# EAGLE design cerebro5.1 (EAGLE 7.7.0)
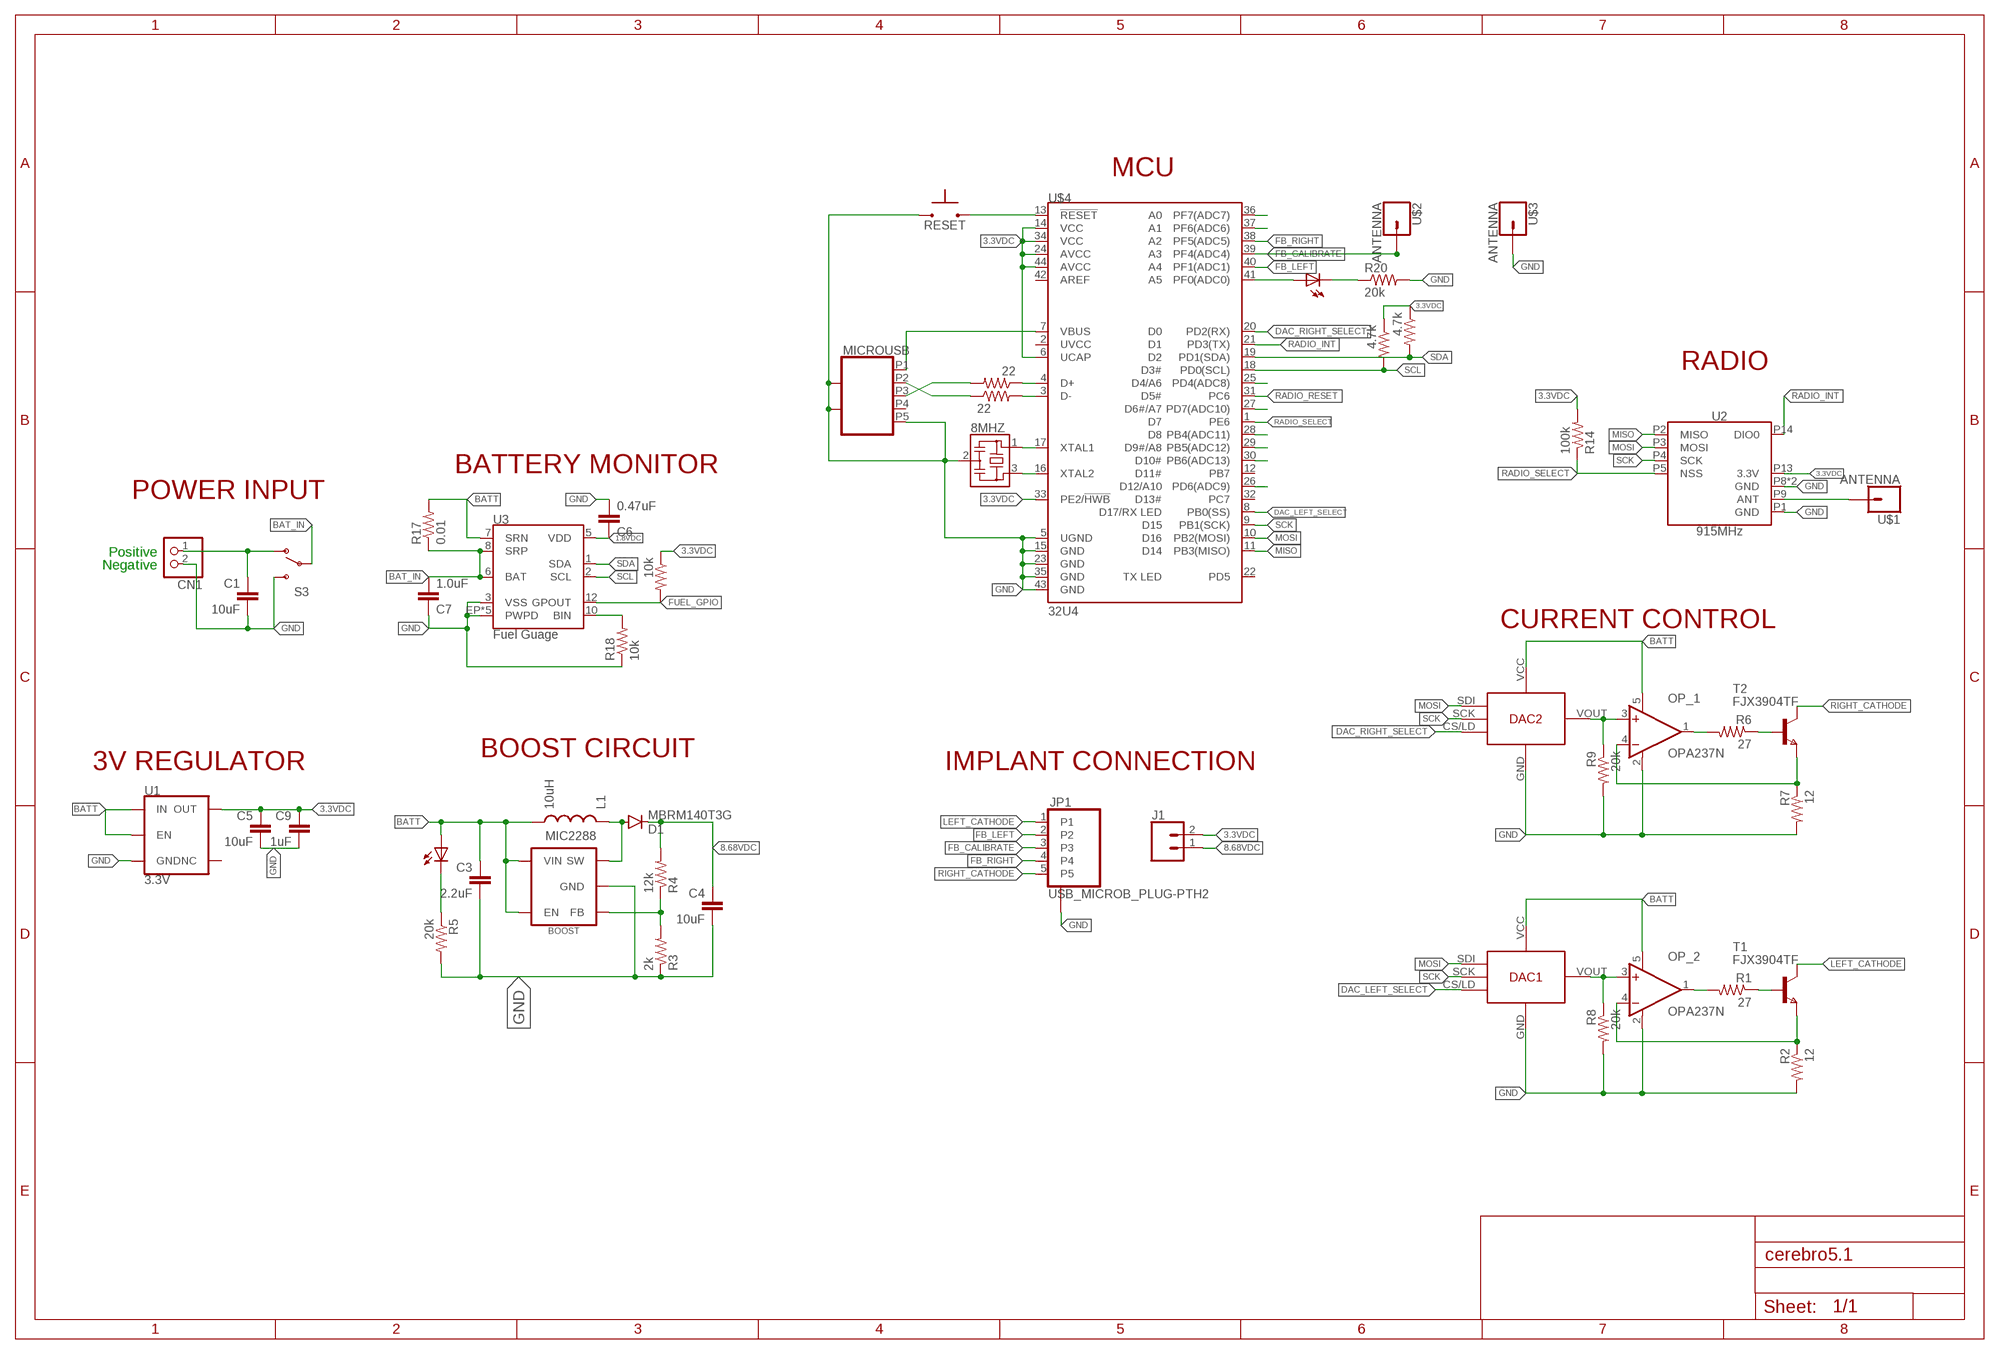
[diagram p0: schematic, sheet 1]

## Parts
8MHZ  RESONATOR_CSTCE_V  [CSTCE_V]
C1  10uF  10UF-0805-10V-10%  [0805]
C3  2.2uF  2.2UF-0805-25V-(+80/-20%)  [0805]
C4  10uF  10UF-0805-10V-10%  [0805]
C5  10uF  10UF-0805-10V-10%  [0805]
C6  0.47uF  10UF-0805-10V-10%  [0805]
C7  1.0uF  10UF-0805-10V-10%  [0805]
C9  1uF  10UF-0805-10V-10%  [0805]
CN1  JST_2PIN-SMT-RA  [JST-PH-2-SMT-RA]
D1  MBRM140T3G  DIODEPOWERMITE  [POWERMITE]
DAC1  DAC_LTC2630  [SC-70]
DAC2  DAC_LTC2630  [SC-70]
INDICATOR_LED  LED  LEDCHIP-LED0603  [CHIP-LED0603]
INDICATOR_LED1  LED  LEDCHIP-LED0603  [CHIP-LED0603]
J1  CONN_02  [1X02]
JP1  USB_MICROB_PLUG-PTH2  [MICRO-B-TH]
L1  10uH  INDUCTORLQH4  [1812]
MIC2288  BOOST  BOOST_CONVERTER  [SOT23-5]
MICROUSB  USB_MICRO_SOCKET_HORZ_REINFORCED  [USB_HORZ_REINFORCED_MICRO]
OP_1  OPA237N  [SOT23-5]
OP_2  OPA237N  [SOT23-5]
R1  27  RESISTOR0603-RES  [0603-RES]
R2  12  RESISTOR0603-RES  [0603-RES]
R3  2k  RESISTOR0603-RES  [0603-RES]
R4  12k  RESISTOR0805-RES  [0805]
R5  20k  RESISTOR0603-RES  [0603-RES]
R6  27  RESISTOR0603-RES  [0603-RES]
R7  12  RESISTOR0603-RES  [0603-RES]
R8  20k  RESISTOR0603-RES  [0603-RES]
R9  20k  RESISTOR0603-RES  [0603-RES]
R12  22  RESISTOR0603-RES  [0603-RES]
R13  22  RESISTOR0603-RES  [0603-RES]
R14  100k  RESISTOR0603-RES  [0603-RES]
R15  4.7k  RESISTOR0603-RES  [0603-RES]
R16  4.7k  RESISTOR0603-RES  [0603-RES]
R17  0.01  RESISTOR1206  [1206]
R18  10k  RESISTOR0603-RES  [0603-RES]
R19  10k  RESISTOR0603-RES  [0603-RES]
R20  20k  RESISTOR0603-RES  [0603-RES]
RESET  SWITCH-MOMENTARY-NO  [SWITCH_MOMENTARY_XS]
S3  SWITCH-SPDTSMD2  [SWITCH-SPDT-SMD]
T1  FJX3904TF  NPNSOT323  [SOT323]
T2  FJX3904TF  NPNSOT323  [SOT323]
U1  3.3V  V_REG_AP2112K-3.3V  [SOT23-5]
U2  915MHz  RFM69HCW-915  [RFM69HCW-XXXS2]
U3  Fuel Guage  BQ27441-G1  [PDSO-N12]
U$1  ANTENNA  [1X01]
U$2  ANTENNA  [1X01]
U$3  ANTENNA  [1X01]
U$4  32U4  ATMEGA32U4QFN2  [QFN-44-NOPAD]

## Nets
1.8VDC: C6.1 U3.5(VDD)
3.3VDC: C5.1 C9.1 J1.2 R14.2 R15.1 R16.1 R19.1 U1.5(OUT) U2.P13(3.3V) U$4.6(UCAP) U$4.14(VCC) U$4.24(AVCC) U$4.33(PE2/!HWB) U$4.34(VCC) U$4.44(AVCC)
8.68VDC: C4.1 D1.CATHODE(C) J1.1 R4.2
BAT_IN: C7.2 R17.1 S3.2(P) U3.6(BAT) U3.8(SRP)
BATT: C3.1 DAC1.VCC(VIN) DAC2.VCC(VIN) INDICATOR_LED.A L1.P$2 L1.P$4 MIC2288.4(EN) MIC2288.5(VIN) OP_1.5(V+) OP_2.5(V+) R17.2 U1.1(IN) U1.3(EN) U3.7(SRN)
DAC_LEFT_SELECT: DAC1.CS/LD U$4.8(PB0(SS))
DAC_RIGHT_SELECT: DAC2.CS/LD U$4.20(PD2(RX))
FB_CALIBRATE: JP1.3 U$2.1 U$4.39(PF4(ADC4))
FB_LEFT: JP1.2 U$4.40(PF1(ADC1))
FB_RIGHT: JP1.4 U$4.38(PF5(ADC5))
FUEL_GPIO: R19.2 U3.12(GPOUT)
GND: 8MHZ.2 C1.2 C3.2 C4.2 C5.2 C6.2 C7.1 C9.2 CN1.2 DAC1.GND DAC2.GND JP1.P$1(GND_PINS) JP1.P$2(GND_PINS) MIC2288.2(GND) MICROUSB.G1 MICROUSB.G2 MICROUSB.P5 MICROUSB.P$1 MICROUSB.P$2 OP_1.2(V-) OP_2.2(V-) R2.2 R3.1 R5.2 R7.2 R8.2 R9.2 R18.1 R20.2 RESET.P$1 S3.3(S) U1.2(GND) U2.P1(GND) U2.P8(GND) U2.P10(GND) U3.3(VSS) U3.EP1(PWPD) U3.EP2(PWPD) U3.EP3(PWPD) U3.EP4(PWPD) U3.EP(PWPD) U$3.1 U$4.5(UGND) U$4.15(GND) U$4.23(GND) U$4.35(GND) U$4.43(GND)
LEFT_CATHODE: JP1.1 T1.1(C)
MISO: U2.P2(MISO) U$4.11(PB3(MISO))
MOSI: DAC1.SDI DAC2.SDI U2.P3(MOSI) U$4.10(PB2(MOSI))
N$1: DAC2.VOUT OP_1.3(+IN) R9.1
N$2: OP_1.4(-IN) R7.1 T2.3(E)
N$3: DAC1.VOUT OP_2.3(+IN) R8.1
N$4: C1.1 CN1.1 S3.1(O)
N$5: OP_1.1(OUT) R6.2
N$6: OP_2.4(-IN) R2.1 T1.3(E)
N$7: R6.1 T2.2(B)
N$8: INDICATOR_LED.C R5.1
N$9: OP_2.1(OUT) R1.2
N$10: MIC2288.3(FB) R3.2 R4.1
N$11: R1.1 T1.2(B)
N$12: 8MHZ.1 U$4.17(XTAL1)
N$13: 8MHZ.3 U$4.16(XTAL2)
N$14: MICROUSB.P1 U$4.7(VBUS)
N$15: D1.ANODE(A) L1.P$1 L1.P$3 MIC2288.1(SW)
N$16: R12.1 U$4.4(D+)
N$17: R13.2 U$4.3(D-)
N$18: MICROUSB.P3 R12.2
N$19: MICROUSB.P2 R13.1
N$21: INDICATOR_LED1.A U$4.41(PF0(ADC0))
N$22: U2.P9(ANT) U$1.1
N$23: U$4.37(PF6(ADC6))
N$24: INDICATOR_LED1.C R20.1
N$25: U$4.36(PF7(ADC7))
N$26: R18.2 U3.10(BIN)
N$27: U$4.28(PB4(ADC11))
N$28: U$4.29(PB5(ADC12))
N$29: U$4.27(PD7(ADC10))
N$30: U$4.30(PB6(ADC13))
N$31: U$4.25(PD4(ADC8))
N$32: U$4.26(PD6(ADC9))
RADIO_INT: U2.P14(DIO0) U$4.21(PD3(TX))
RADIO_RESET: U$4.31(PC6)
RADIO_SELECT: R14.1 U2.P5(NSS) U$4.1(PE6)
RESET: RESET.P$2 U$4.13(!RESET)
RIGHT_CATHODE: JP1.5 T2.1(C)
SCK: DAC1.SCK DAC2.SCK U2.P4(SCK) U$4.9(PB1(SCK))
SCL: R15.2 U3.2(SCL) U$4.18(PD0(SCL))
SDA: R16.2 U3.1(SDA) U$4.19(PD1(SDA))
Unconnected: MICROUSB.P4 U1.4(NC) U$4.2(UVCC) U$4.12(PB7) U$4.22(PD5) U$4.32(PC7) U$4.42(AREF)

## Notes on the sheet
- MCU
- RADIO
- BATTERY MONITOR
- POWER INPUT
- Positive
- Negative
- CURRENT CONTROL
- BOOST CIRCUIT
- 3V REGULATOR | IMPLANT CONNECTION

## Library data of the parts
8MHZ = Cerebro-library:RESONATOR: 16 MHz Resonator(Murata p/n CSTCE16M0V53-R0) Digikey: 490-1198-1-ND <http://www.digikey.com/product-search/en?keywords=490-1198-1-nd>
C1 C4 C5 = Cerebro-library:10UF: 10.0µF ceramic capacitors A capacitor is a passive two-terminal electrical component used to store electrical energy temporarily in an electric field.; PROD_ID: CAP-11330
C3 = Cerebro-library:2.2UF: 2.2µF ceramic capacitors A capacitor is a passive two-terminal electrical component used to store electrical energy temporarily in an electric field.; PROD_ID: CAP-11624
C6 C7 C9 = Cerebro-library:10UF: 10.0µF ceramic capacitors A capacitor is a passive two-terminal electrical component used to store electrical energy temporarily in an electric field.; PROD_ID: CAP-11330; VALUE: 10uF
CN1 = Cerebro-library:JST_2PIN: JST 2-Pin Connectors of various flavors SMT-RA (S2B-PH-SM4) 4UConnector #17311 SMT (B2B-PH-SM4) THM-RA (S2B-PH) THM (B2B-PH)
D1 = Cerebro-library:DIODE: Diode These are standard reverse protection diodes and small signal diodes. SMA package can handle up to about 1A. SOD-323 can handle about 200mA. What the SOD-323 package when ordering, there are some mfgs out there that are 5-pin packages.
DAC1 DAC2 = Cerebro-library:DAC_LTC2630
INDICATOR_LED INDICATOR_LED1 = led:LED: LED OSRAM: - CHIPLED LG R971, LG N971, LY N971, LG Q971, LY Q971, LO R971, LY R971 LH N974, LH R974 LS Q976, LO Q976, LY Q976 LO Q996 - Hyper CHIPLED LW Q18S LB Q993, LB Q99A, LB R99A - SideLED LS A670, LO A670, LY A670, LG A670, LP A670 LB A673, LV A673, LT A673, LW A673 LH A674 LY A675 LS A676, LA A676, LO A676, LY A676, LW A676 LS A679, LY A679, LG A679 - Hyper Micro SIDELED® LS Y876, LA Y876, LO Y876, LY Y876 LT Y87S - SmartLED LW L88C, LW L88S LB L89C, LB L89S, LG L890 LS L89K, LO L89K, LY L89K LS L896, LA L896, LO L896, LY L896 - TOPLED LS T670, LO T670, LY T670, LG T670, LP T670 LSG T670, LSP T670, LSY T670, LOP T670, LYG T670 LG T671, LOG T671, LSG T671 LB T673, LV T673, LT T673, LW T673 LH T674 LS T676, LA T676, LO T676, LY T676, LB T676, LH T676, LSB T676, LW T676 LB T67C, LV T67C, LT T67C, LS T67K, LO T67K, LY T67K, LW E67C LS E67B, LA E67B, LO E67B, LY E67B, LB E67C, LV E67C, LT E67C LW T67C LS T679, LY T679, LG T679 LS T770, LO T770, LY T770, LG T770, LP T770 LB T773, LV T773, LT T773, LW T773 LH T774 LS E675, LA E675, LY E675, LS T675 LS T776, LA T776, LO T776, LY T776, LB T776 LHGB T686 LT T68C, LB T68C - Hyper Mini TOPLED® LB M676 - Mini TOPLED Santana® LG M470 LS M47K, LO M47K, LY M47K Source: http://www.osram.convergy.de LUXEON: - LUMILED® LXK2-PW12-R00, LXK2-PW12-S00, LXK2-PW14-U00, LXK2-PW14-V00 LXK2-PM12-R00, LXK2-PM12-S00, LXK2-PM14-U00 LXK2-PE12-Q00, LXK2-PE12-R00, LXK2-PE12-S00, LXK2-PE14-T00, LXK2-PE14-U00 LXK2-PB12-K00, LXK2-PB12-L00, LXK2-PB12-M00, LXK2-PB14-N00, LXK2-PB14-P00, LXK2-PB14-Q00 LXK2-PR12-L00, LXK2-PR12-M00, LXK2-PR14-Q00, LXK2-PR14-R00 LXK2-PD12-Q00, LXK2-PD12-R00, LXK2-PD12-S00 LXK2-PH12-R00, LXK2-PH12-S00 LXK2-PL12-P00, LXK2-PL12-Q00, LXK2-PL12-R00 Source: www.luxeon.com KINGBRIGHT: KA-3528ASYC Source: www.kingbright.com
J1 = Cerebro-library:CONN_02: Multi connection point. Often used as Generic Header-pin footprint for 0.1 inch spaced/style header connections On any of the 0.1 inch spaced packages, you can populate with these: Break Away Headers - Straight <https://www.sparkfun.com/products/116> (PRT-00116) Break Away Male Headers - Right Angle <https://www.sparkfun.com/products/553> (PRT-00553) Female Headers <https://www.sparkfun.com/products/115> (PRT-00115) Break Away Headers - Machine Pin <https://www.sparkfun.com/products/117> (PRT-00117) Break Away Female Headers - Swiss Machine Pin <https://www.sparkfun.com/products/743> (PRT-00743) For SCREWTERMINALS and SPRING TERMINALS visit here: Screw Terimnals on SparkFun.com <https://www.sparkfun.com/search/results?term=Screw+Terminals> (5mm/3.5mm/2.54mm spacing) This device is also useful as a general connection point to wire up your design to another part of your project. Our various solder wires solder well into these plated through hole pads. Hook-Up Wire - Assortment (Stranded, 22 AWG) <https://www.sparkfun.com/products/11375> (PRT-11375) Hook-Up Wire - Assortment (Solid Core, 22 AWG) <https://www.sparkfun.com/products/11367> (PRT-11367) View the entire wire category on our website here <https://www.sparkfun.com/categories/141> Special notes: Molex polarized connector foot print use with: PRT-08233 with associated crimp pins and housings. 2.54_SCREWTERM for use with PRT-10571. 3.5mm Screw Terminal footprints for PRT-08084 5mm Screw Terminal footprints for use with PRT-08432
JP1 = Cerebro-library:USB_MICROB_PLUG: USB Micro-B connectors Some male, some female. Watch your step!
L1 = Cerebro-library:INDUCTOR: Inductors Basic Inductor/Choke - 0603 and 1206. Footprints are not proven and vary greatly between part numbers. SRN6045- 33uH, 20% 1.4A SDR0403-560KL - 56uH, 10%, 500mA RMS/740mA peak
MIC2288 = Cerebro-library:BOOST_CONVERTER
MICROUSB = Cerebro-library:USB_MICRO_SOCKET: horizontal socket. Digikey 609-4616-1-ND
OP_1 OP_2 = Cerebro-library:OPA237: Operational Amplifiers Single-Supply, MicroAmplifier(TM) Series; MF: TEXAS INSTRUMENTS; MPN: OPA237NA/250; OC_FARNELL: 4625298; OC_NEWARK: 35C1874
R1-R9 R12-R20 = Cerebro-library:RESISTOR: Resistor Basic schematic elements and footprints for 0603, 1206, and PTH resistors.
RESET = Cerebro-library:SWITCH-MOMENTARY-NO
S3 = Cerebro-library:SWITCH-SPDT: SPDT Switch slide switch: AYZ0102AGRLC <http://www.digikey.com/product-detail/en/c-k/AYZ0102AGRLC/401-2012-1-ND/1640121> vertical toggle: ATE1D-2M3-10-Z <http://www.digikey.com/product-search/en?keywords=ATE1D-2M3-10-Z> horizontal toggle: ATE1D-5M3-10-Z <http://www.digikey.com/product-search/en?keywords=ATE1D-5M3-10-Z>
T1 T2 = Cerebro-library:NPNSOT323: NPN TRANSISTOR; MPN: DSS4160U-7; OC_FARNELL: 1710696; OC_NEWARK: 25R4558
U1 = Cerebro-library:V_REG_AP2112: AP2112 - 600mA CMOS LDO Regulator w/ Enable The AP2112 is CMOS process low dropout linear regulator with enable function, the regulator delivers a guaranteed 600mA (min.) continuous load current. Features Output Voltage Accuracy: ±1.5% Output Current: 600mA (Min.) Foldback Short Current Protection: 50mA Enable Function to Turn ON/OFF VOUT Low Dropout Voltage (3.3V): 250mV (Typ.) @IOUT=600mA Excellent Load Regulation: 0.2%/A (Typ.) Excellent Line Regulation: 0.02%/V (Typ.) Low Quiescent Current: 55μA (Typ.) Low Standby Current: 0.01μA (Typ.) Low Output Noise: 50μVRMS PSRR: 100Hz -65dB, 1kHz -65dB OTSD Protection Stable with 1.0μF Flexible Cap: Ceramic, Tantalum and Aluminum Electrolytic Operation Temperature Range: -40°C to 85°C ESD: MM 400V, HBM 4000V; PROD_ID: VREG-12457
U2 = Cerebro-library:RFM69H: Hope RF RFM69H ISM Transceiver Module The RFM69H is a transceiver module capable of operation over a wide frequency range, including the 315,433,868 and 915MHz license-free ISM (Industry Scientific and Medical) frequency bands. All major RF communication parameters are programmable and most of them can be dynamically set. The RFM69H offers the unique advantage of programmable narrow-band and wide- band communication modes. The RFM69H is optimized for low power consumption while offering high RF output power and channelized operation.Compliance ETSI and FCC regulations. Datasheet <http://www.hoperf.cn/upload/docs/RF/SX/RFM69H_DataSheet_v1.3.pdf> SparkFun Products RFM69HCW Wireless Transceiver - 915MHz <https://www.sparkfun.com/products/13909> (COM-13909) RFM69HCW Wireless Transceiver - 434MHz <https://www.sparkfun.com/products/13910> (COM-13910) SparkFun RFM69 Breakout (915MHz) <https://www.sparkfun.com/products/12775> (WRL-12775) SparkFun RFM69 Breakout (434MHz) <https://www.sparkfun.com/products/12823> (WRL-12823); PROD_ID: IC-11997
U3 = Cerebro-library:BQ27441-G1: Texas Instruments BQ27441-G1 LiPo Battery Fuel Gauge The Texas Instruments bq27441-G1 fuel gauge is a microcontroller peripheral that provides system-side fuel gauging for single-cell Li-Ion batteries. The device requires minimal user configuration and system microcontroller firmware development. The bq27441-G1 battery fuel gauge uses the patented Impedance Track™ algorithm for fuel gauging, and provides information such as remaining battery capacity (mAh), state-of-charge (%), and battery voltage (mV). Datasheet <http://www.ti.com/product/BQ27441-G1/datasheet> SparkFun Products SparkFun Battery Babysitter <https://www.sparkfun.com/products/13777> (PRT-13777); PROD_ID: IC-13220
U$1-U$3 = Cerebro-library:ANTENNA
U$4 = Cerebro-library:ATMEGA32U4: Atmel MCU, 32KByte Atmel 44-pin 8-bit Microcontroller with 32KBytes of ISP Flash and USB Controller Datasheet <http://cdn.sparkfun.com/datasheets/Dev/Arduino/Boards/ATMega32U4.pdf> SparkFun Products LilyPad Arduino USB - ATmega32U4 Board <https://www.sparkfun.com/products/12049> (DEV-12049) Pro Micro - 5V/16MHz <https://www.sparkfun.com/products/12640> (DEV-12640) Pro Micro - 3.3V/8MHz <https://www.sparkfun.com/products/12587> (DEV-12587) Fio v3 - ATmega32U4 <https://www.sparkfun.com/products/11520> (DEV-11520) Qduino Mini <https://www.sparkfun.com/products/13614> (DEV-13614) Makey Makey - Standard Kit <https://www.sparkfun.com/products/11511> (WIG-11511) Makey Makey Deluxe Kit <https://www.sparkfun.com/products/11519> (WIG-11519); PROD_ID: IC-10828

## Board
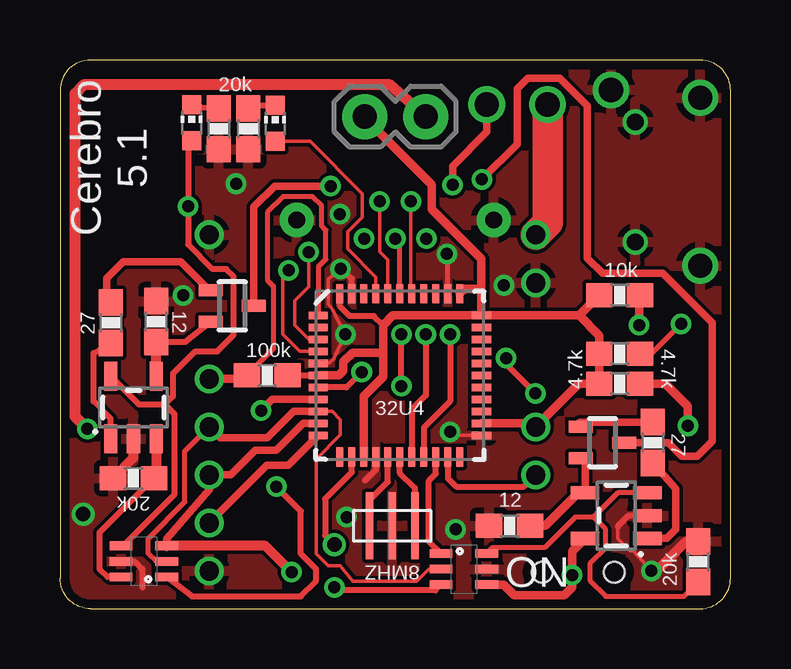
[diagram p1: board, top side]
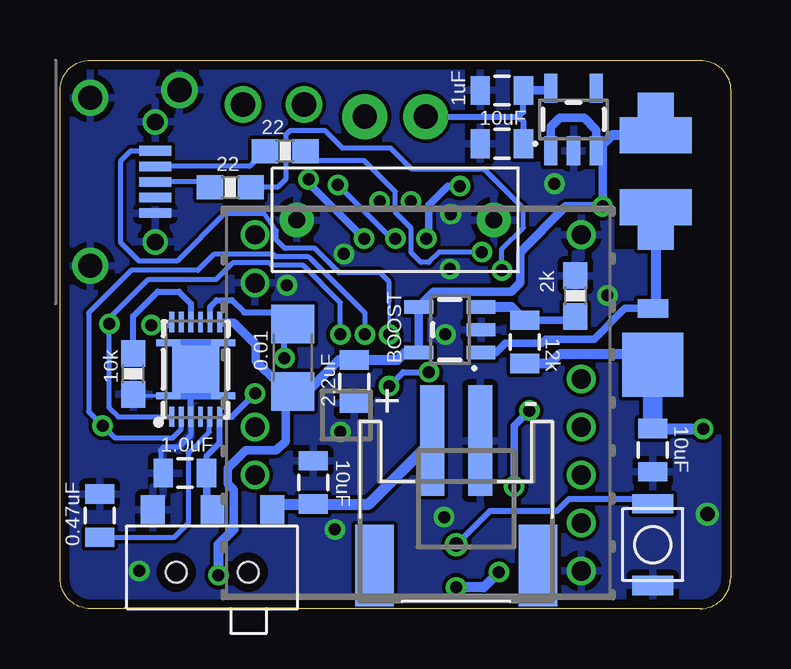
[diagram p2: board, bottom side, seen from below]

Size 27.94 x 22.86 mm. Coordinates in mm from the lower left corner, seen from the top.
Outline: 1.27,0 26.67,0 arc90 27.94,1.27 27.94,21.59 arc90 26.67,22.86 1.27,22.86 arc90 0,21.59 0,1.27 arc90 1.27,0
Copper layers (1*16): Top 0.0356mm / dielectric 1.5011mm / Bottom 0.0356mm
Design rules "LaenPCBOrder *": minimum track width 6mil, minimum drill 13mil, track to track 6mil, track to pad 6mil, pad to pad 6mil, via to via 6mil, smd to smd 6mil, copper to edge 15mil, drill to drill 6mil, minimum pad ring 7mil, minimum via ring 7mil, stop-mask expansion 3mil, vias tented up to drill 25mil, thermal gap 10mil
bRestrict: area 1.5,15 to 4.8,21.6

### Footprints (pad centres in the part's own frame; a part is rotated, then mirrored left to right if it is on the bottom)
CSTCE_V = smd 0.3 x 2.794: 1 -0.95,0; 2 0,0; 3 0.95,0
0805 = smd 0.8 x 1.2: 1 -0.9,0; 2 0.9,0
JST-PH-2-SMT-RA = smd 1 x 4.6: 1 1,-3.7; 2 -1,-3.7 | smd 1.6 x 3.4: NC1 -3.4,1.5; NC2 3.4,1.5
POWERMITE = smd 0.762 x 1.27: ANODE 0.699,0 | smd 2.667 x 2.54: CATHODE -1.651,0
SC-70 = smd 0.36 x 0.95: CS/LD -0.65,-0.95; GND 0,0.95; SCK 0,-0.95; SDI 0.65,-0.95; VCC 0.65,0.95; VOUT -0.65,0.95
CHIP-LED0603 = smd 0.8 x 0.8: A 0,-0.75; C 0,0.75
1X02 = drill 1.016 pad 1.88: 1 -1.27,0; 2 1.27,0
MICRO-B-TH = drill 0.5 pad 0.813: 1 -1.3,-0.775; 2 -0.65,0.775; 3 0,-0.775; 4 0.65,0.775; 5 1.3,-0.775 | drill 0.7 pad 1.422: P$1 -4.1,0; P$2 4.1,0
1812 = smd 1.499 x 2.997: P$1 -1.499,0; P$2 1.499,0 | smd 1.016 x 1.499: P$3 -2.756,0; P$4 2.756,0
SOT23-5 = smd 0.55 x 1.2: 1 -0.95,-1.3; 2 0,-1.3; 3 0.95,-1.3; 4 0.95,1.3; 5 -0.95,1.3
USB_HORZ_REINFORCED_MICRO = drill 1: G1 -3.5,0; G2 3.5,0 | smd 0.4 x 1.35: P1 -1.3,2.7; P2 -0.65,2.7; P3 0,2.7; P4 0.65,2.7; P5 1.3,2.7 | drill 0.7: P$1 -2.5,2.7; P$2 2.5,2.7
0603-RES = smd 1.1 x 1: 1 -0.85,0; 2 0.85,0
1206 = smd 1.6 x 1.8: 1 -1.4,0; 2 1.4,0
SWITCH_MOMENTARY_XS = smd 0.8 x 1.7: P$1 -1.7,0; P$2 1.7,0
SWITCH-SPDT-SMD = smd 0.991 x 1.194: 1 -2.489,-2.603; 2 0,-2.603; 3 2.489,-2.603 | hole 0.864: -1.499,0; 1.499,0
SOT323 = smd 0.5 x 1: 1 0,0.9; 2 -0.65,-0.9; 3 0.65,-0.9
RFM69HCW-XXXS2 = drill 0.8: P1 -6.8,7; P2 -6.8,5; P3 -6.8,3; P4 -6.8,1; P5 -6.8,-1; P8 -6.8,-7; P9 6.8,-7; P10 6.8,-5; P13 6.8,1; P14 6.8,3
PDSO-N12 = smd 0.2 x 0.85: 1 -1,-1.975; 2 -0.6,-1.975; 3 -0.2,-1.975; 4 0.2,-1.975; 5 0.6,-1.975; 6 1,-1.975; 7 1,1.975; 8 0.6,1.975; 9 0.2,1.975; 10 -0.2,1.975; 11 -0.6,1.975; 12 -1,1.975 | smd 1.95 x 1.95: EP 0,0 | smd 1 x 0.25: EP1 -1.15,1.1; EP2 -1.15,-1.1; EP3 1.15,-1.1; EP4 1.15,1.1
1X01 = drill 1.016 pad 1.422: 1 0,0
QFN-44-NOPAD = smd 0.8 x 0.3: 1 -3.4,2.5; 2 -3.4,2; 3 -3.4,1.5; 4 -3.4,1; 5 -3.4,0.5; 6 -3.4,0; 7 -3.4,-0.5; 8 -3.4,-1; 9 -3.4,-1.5; 10 -3.4,-2; 11 -3.4,-2.5; 23 3.4,-2.5; 24 3.4,-2; 25 3.4,-1.5; 26 3.4,-1; 27 3.4,-0.5; 28 3.4,0; 29 3.4,0.5; 30 3.4,1; 31 3.4,1.5; 32 3.4,2; 33 3.4,2.5 | smd 0.3 x 0.8: 12 -2.5,-3.4; 13 -2,-3.4; 14 -1.5,-3.4; 15 -1,-3.4; 16 -0.5,-3.4; 17 0,-3.4; 18 0.5,-3.4; 19 1,-3.4; 20 1.5,-3.4; 21 2,-3.4; 22 2.5,-3.4; 34 2.5,3.4; 35 2,3.4; 36 1.5,3.4; 37 1,3.4; 38 0.5,3.4; 39 0,3.4; 40 -0.5,3.4; 41 -1,3.4; 42 -1.5,3.4; 43 -2,3.4; 44 -2.5,3.4

### Placement (x,y rotation side)
8MHZ  13.84,3.45 180 top
C1  17.39,5.26 90 bottom
C3  15.68,9.46 270 bottom
C4  3.24,6.6 270 bottom
C5  9.53,19.37 180 bottom
C6  26.29,3.87 90 bottom
C7  22.73,5.65 0 bottom
C9  9.53,21.59 180 bottom
CN1  11.43,3.3 180 bottom
D1  3.24,11.81 90 bottom
DAC1  3.49,1.97 90 top
DAC2  16.83,1.65 270 top
INDICATOR_LED  5.49,20.24 0 top
INDICATOR_LED1  8.97,20.22 0 top
J1  13.97,20.5 180 top
JP1  13.97,16.19 0 top
L1  3.11,18.22 90 bottom
MIC2288  11.7,11.62 90 bottom
MICROUSB  26.67,17.78 270 bottom
OP_1  23.18,3.87 90 top
OP_2  3.06,8.38 0 top
R1  2.12,11.91 270 top
R2  4,11.96 90 top
R3  6.46,13.03 270 bottom
R4  8.57,11.11 270 bottom
R5  6.62,19.99 270 top
R6  24.7,6.92 270 top
R7  18.73,3.45 180 top
R8  3.06,5.44 180 top
R9  26.59,1.95 90 top
R12  20.84,17.55 180 bottom
R13  18.55,19.06 0 bottom
R14  8.64,9.72 0 top
R15  23.32,9.37 0 top
R16  23.32,10.62 0 top
R17  18.24,10.45 270 bottom
R18  24.89,9.78 90 bottom
R19  23.32,13.06 0 top
R20  7.85,19.99 270 top
RESET  3.24,2.67 90 bottom
S3  21.59,1.52 180 bottom
T1  7.18,12.61 270 top
T2  22.61,6.92 270 top
U1  6.54,20.38 0 bottom
U2  13.02,8.57 180 bottom
U3  22.29,9.97 0 bottom
U$1  20.32,21.01 0 top
U$2  17.78,21.01 0 top
U$3  22.96,21.62 0 top
U$4  14.16,9.72 0 top

### Tracks (layer width: path | path; a pad name or v marks a point on that pad's centre or on a via)
1.8VDC
  Bottom 0.152: 21.72,7.97 U3.5
  Bottom 0.203: C6.1 23.19,2.97 22.61,3.56 22.61,6.48 21.72,7.37 21.72,7.97
3.3VDC
  Top 0.254: 11.68,13.09 U$4.44 11.66,12.6 12.06,12.19 13.08,12.19 13.46,11.81 | R14.2 U$4.6
  Top 0.356: U$4.14 12.66,8.85 13.46,9.65 13.46,10.67 | U$4.24 19.67,7.71 U2.P13 21.62,9.37 R15.1 R16.1 22.47,11.38 21.63,12.22 | U$4.6 11.62,9.72 11.81,9.91 11.81,10.29 12.19,10.67 13.46,10.67 | 17.56,13.34 U$4.33 | U$4.34 16.88,13.34 17.56,13.34 | 13.46,10.67 13.46,11.81 13.87,12.22 U$4.33 | J1.2 13.34,19.81 15.49,17.65 15.49,16.64 17.56,14.57 17.56,13.34 | U$4.33 21.63,12.22 | 21.63,12.22 R19.1
  Bottom 0.254: J1.2 8.84,20.5 | 8.84,20.5 8.64,20.7 8.64,21.58 C9.1 | C5.1 8.62,20.29 8.84,20.5
  Bottom 0.356: U1.5 7.58,21.59 C9.1
8.68VDC  (via drill 0.5 pad 0.25)
  Top 0.457: J1.1 13.72,21.84 1.02,21.84 0.64,21.46 0.64,8 v1.14,7.49
  Bottom 0.305: 3.24,10.48 D1.CATHODE
  Bottom 0.406: 3.24,10.48 3.43,10.59 7.14,10.59 7.54,10.21 R4.2
  Bottom 0.457: C4.1 1.14,7.5
  Bottom 0.61: 1.14,7.5 v1.14,7.49
  Bottom 0.813: C4.1 D1.CATHODE
BAT_IN  (via drill 0.5)
  Top 0.254: v19.81,8.97 18.59,10.19 v18.59,10.44
  Bottom 0.254: C7.2 21.83,6.36 21.29,6.91 U3.6 20.78,8 v19.81,8.97 | U3.8 21.69,12.58 21.41,12.85 20.78,12.85 20.27,12.34 18.88,12.34 18.6,12.06 | v18.59,10.44 18.59,11.5 R17.1
  Bottom 0.305: 18.6,12.06 R17.1 | S3.2 21.83,4.37 C7.2
BATT  (via drill 0.5 pad 0.25)
  Top 0.152: DAC1.VCC 2.87,2.62
  Top 0.254: 21.59,3.02 OP_1.5 | OP_2.5 3.28,8.51 4.37,8.51 | DAC1.VCC 2.59,2.67 2.67,2.67 4.78,4.78 4.78,8.1 4.37,8.51 | INDICATOR_LED.A 5.33,19.34 v5.33,16.76 5.33,15.16 6.35,14.15 6.93,14.15 7.24,13.84 7.24,11.4 6.55,10.72 5.64,10.72 4.7,9.78 4.7,8.84 4.37,8.51
  Top 0.356: OP_1.5 21.34,2.38 v21.34,1.4 21.34,0.89 21.01,0.56 18.92,0.56 18.48,1 DAC2.VCC
  Bottom 0.152: v5.33,16.76 5.33,17.68
  Bottom 0.203: U3.7 21.29,11.92 21.09,11.92
  Bottom 0.254: L1.P$4 L1.P$2 | 18.73,9.4 R17.2 | U1.3 5.33,19.34
  Bottom 0.356: MIC2288.5 MIC2288.4 12.36,13.21 9.14,13.21 8.76,13.59 8.76,14.86 6.86,16.76 v5.33,16.76 5.33,19.34 | U1.3 5.59,19.94 6.1,20.45 7.11,20.45 7.49,20.07 U1.1 | 20.7,3.3 20.7,4.95 20.95,5.21 20.95,5.84 20.19,6.6 18.92,6.6 18.54,6.99 18.54,8.7 18.73,8.89 | 21.09,11.92 20.71,11.92 19.79,11 19.79,10.31 18.9,9.42
  Bottom 0.406: 20.7,3.3 21.34,2.67 v21.34,1.4 | R17.2 18.6,9.14 17.53,9.14 16.31,10.36 C3.1 13.87,10.36 13.59,10.64 13.03,10.64 MIC2288.5 | 18.9,9.42 18.73,8.89 R17.2 | 18.54,9 arc-90 R17.2 | L1.P$2 4.95,19.72 U1.3
DAC_LEFT_SELECT  (via drill 0.5)
  Top 0.254: DAC1.CS/LD 5.51,0.51 10.03,0.51 10.67,1.14 10.67,1.65 10.03,2.29 10.03,4.06 v9.02,5.08
  Top 0.305: U$4.8 8.84,8.72 v8.38,8.26
  Bottom 0.305: v9.02,5.08 9.02,7.62 v8.38,8.26
DAC_RIGHT_SELECT
  Top 0.254: DAC2.CS/LD 15.37,2.81 15.37,5.33 15.66,5.63 U$4.20
FB_CALIBRATE  (via drill 0.5)
  Top 0.203: U$4.39 14.16,15.23 JP1.3
  Top 0.305: v16.36,17.65 16.36,18.44 17.78,19.86 U$2.1
  Bottom 0.203: JP1.3 14.12,15.42 v16.36,17.65
FB_LEFT
  Top 0.152: U$4.40 13.66,14.53 13.32,14.87 JP1.2
FB_RIGHT
  Top 0.152: JP1.4 14.62,13.16 U$4.38
FUEL_GPIO  (via drill 0.5 pad 0.25)
  Top 0.356: v24.13,11.81 24.13,13.02 R19.2
  Bottom 0.254: U3.12 23.42,11.81 v24.13,11.81
GND  (via drill 0.5, 0.5 pad 0.25, 0.6)
  Top 0.152: v16.26,7.37 16.41,7.21 U$4.23 | 23.24,3.43 23.24,2.92 23.75,2.41 23.88,2.41 v24.64,1.57 | v11.7,14.16 11.18,13.72 11.18,12.7 11.37,12.45 11.49,12.19 v11.89,11.43 11.4,10.41 11.21,10.22 U$4.5
  Top 0.203: U$4.35 16.16,14.74 v16.12,14.78
  Top 0.254: U$4.15 13.16,5.79 12.7,5.33 | DAC1.GND 3.11,1.97 3.43,1.65 3.43,0.89 | OP_1.2 23.69,3.87 23.24,3.43 | U$4.43 12.16,13.75 v11.7,14.16
  Top 0.406: v24.64,1.57 25.07,1.78 26.09,2.8 R9.2 | OP_2.2 3.06,6.29 R8.2
  Bottom 0.152: R18.1 24.83,8.87 U3.EP2 23.39,8.87 arc-90 U3.EP | U3.EP4 21.19,11.07 21.84,10.41 | 21.84,10.41 U3.EP | U3.EP1 22.5,11.07 arc90 21.84,10.41 | U3.EP3 21.19,8.87 arc90 U3.EP | 23.63,6.08 C7.1 23.75,5.77
  Bottom 0.203: U3.3 22.49,7.23 22.99,6.73 23.62,6.73 23.75,6.6 23.75,5.77
  Bottom 0.254: U3.3 22.49,9.77 U3.EP
  other vias: 11.94,3.81 0.97,3.94 5.13,13.06 11.66,16.43 18.49,13.47 16.48,3.3 7.34,17.7
  pour Bottom: 30.48,25.4 -2.54,25.4 -2.54,-2.54 30.48,-2.54
  pour Top: -2.54,25.4 30.48,25.4 30.48,-2.54 -2.54,-2.54
LEFT_CATHODE  (via drill 0.5)
  Top 0.305: v11.28,17.6 8.94,17.6 8.07,16.74 T1.1
  Bottom 0.305: JP1.1 12.57,15.51 12.57,16.82 11.79,17.6 v11.28,17.6
MISO
  Top 0.305: U2.P2 8.61,5.97 9.51,5.97 U$4.11
MOSI  (via drill 0.5)
  Top 0.254: v11.43,0.89 11.56,0.76 15.64,0.76 DAC2.SDI
  Top 0.305: U$4.10 10.13,7.71 9.02,6.6 8.13,6.6 7.11,5.59 6.23,5.59 U2.P3 6.22,4.95 4.44,2.92 DAC1.SDI
  Top 0.406: v9.65,1.52 8.56,2.62 DAC1.SDI
  Bottom 0.406: v9.65,1.52 10.29,0.89 v11.43,0.89
N$1
  Top 0.203: OP_1.3 23.24,4.82 22.23,3.81 | R9.1 26,0.51 22.73,0.51 22.1,1.14 22.1,1.91 22.73,2.54 22.73,3.3 22.23,3.81 | 22.23,3.81 21.46,3.81 20.19,2.54 18.02,2.54 DAC2.VOUT
N$2
  Top 0.254: 21.59,4.7 OP_1.4 | 21.88,6.1 T2.3
  Top 0.305: OP_1.4 21.88,6.1
  Top 0.356: R7.1 20.22,3.45 21.59,4.82 OP_1.4
N$3
  Top 0.254: DAC1.VOUT 1.98,1.32 1.65,1.65 1.65,3.18 R8.1
  Top 0.406: OP_2.3 4.01,5.54 R8.1
N$4
  Bottom 0.457: S3.1 18.87,4.36 C1.1 15.07,4.36 CN1.1
N$5
  Top 0.305: OP_1.1 25.28,2.92 25.65,3.3 25.65,4.99 R6.2
N$6
  Top 0.254: R2.1 5.22,11.11 T1.3
  Top 0.406: OP_2.4 4,10.48 R2.1
N$7
  Top 0.305: T2.2 21.65,7.77 R6.1
N$8
  Top 0.254: INDICATOR_LED.C 5.56,20.92 R5.1
N$9
  Top 0.254: OP_2.1 2.11,7.92 1.4,8.64 1.4,10.64 R1.2
N$10
  Bottom 0.305: R4.1 6.63,12.01 R3.2
  Bottom 0.406: MIC2288.3 9.13,12.57 R4.1
N$11
  Top 0.305: T1.2 6.1,13.38 5.03,14.45 2.64,14.45 1.96,13.77 1.96,12.9 R1.1
  Top 0.356: 1.87,13.09 R1.1
N$12
  Top 0.254: 8MHZ.1 14.79,5.02 14.16,5.65 U$4.17
N$13
  Top 0.254: 8MHZ.3 12.89,4.51 13.66,5.28 U$4.16
N$14  (via drill 0.5 pad 0.25)
  Top 0.254: v14.22,9.27 v14.22,11.43 | v12.57,9.86 11.93,9.22 U$4.7
  Bottom 0.152: 14.22,12.8 v14.22,11.43
  Bottom 0.203: MICROUSB.P1 24.99,19.08 25.4,18.67 25.4,15.24 24.64,14.48 23.06,14.48 21.09,16.45 19.43,16.45 18.92,15.75 18.92,15.37 18.57,15.01 17.32,15.01 16.31,13.99 14.61,13.99 14.22,13.61 14.22,12.8
  Bottom 0.254: v14.22,9.27 13.64,9.86 v12.57,9.86
N$15
  Bottom 0.254: L1.P$3 L1.P$1
  Bottom 0.305: 3.11,12.64 D1.ANODE 4.41,12.51 5.69,11.23 7.7,11.23 7.87,11.05 9.4,11.05 9.78,10.67 MIC2288.1
  Bottom 0.406: L1.P$3 3.11,12.51 D1.ANODE
N$16  (via drill 0.5 pad 0.25)
  Top 0.152: v9.53,14.1 9.27,13.84 9.27,11.43 9.99,10.72 U$4.4
  Bottom 0.203: v9.53,14.1 9.53,14.99 8.64,15.88 8.64,16.69 10.29,18.34 13.31,18.34 14.17,19.2 16.18,19.2 16.89,19.91 18.36,19.91 18.54,19.74 18.54,17.88 18.87,17.55 R12.1
N$17  (via drill 0.5 pad 0.25)
  Top 0.152: v10.36,14.86 10.36,13.41 9.78,12.83 9.78,11.81 10.37,11.22 U$4.3
  Bottom 0.203: v10.36,14.86 12.14,14.86 12.57,14.43 12.9,14.43 13.31,14.83 13.31,15.85 13.97,16.51 13.97,17.37 15.27,18.67 17.31,18.67 R13.2
N$18
  Bottom 0.203: R12.2 21.92,17.78 MICROUSB.P3
N$19
  Bottom 0.203: R13.1 20.04,18.43 MICROUSB.P2
N$21
  Top 0.152: U$4.41 13.16,13.81 11.99,14.99 11.99,15.7 12.6,16.31 12.6,17.3 10.43,19.47 INDICATOR_LED1.A
N$22
  Top 1.27: U2.P9 20.32,16.07 U$1.1
N$24
  Top 0.254: R20.1 7.85,20.97 INDICATOR_LED1.C
N$26
  Bottom 0.254: R18.2 24.89,12.19 23.88,13.21 22.99,13.21 22.49,12.71 U3.10
RADIO_INT
  Top 0.254: U$4.21 16.16,5.43 16.51,5.08 19.32,5.08 U2.P14
RADIO_SELECT
  Top 0.152: 7.64,9.57 R14.1 | U$4.1 10.54,12.19
  Top 0.203: U$4.1 10.76,14.24 11.07,14.55 11.07,15.77 10.9,15.95 10.9,16.79 10.52,17.17 9.3,17.17 8.64,16.51 8.64,13.69 8.89,13.44 8.89,10.82 R14.1
  Top 0.356: U2.P5 7.64,9.57
RESET  (via drill 0.6)
  Top 0.254: v11.43,2.67 11.05,3.05 11.05,4.57 12.16,5.68 U$4.13
  Bottom 0.254: v11.43,2.67 10.03,4.06 7.24,4.06 6.73,4.57 3.25,4.57 RESET.P$2
RIGHT_CATHODE  (via drill 0.5)
  Top 0.152: T2.1 23.32,6.99
  Top 0.305: T2.1 25.34,6.92 25.91,6.35 26.54,6.35 27.18,6.99 27.18,11.91 25.12,13.97 22.61,13.97 21.97,14.61 21.97,20.95 20.83,22.1 19.48,22.1 19.05,21.67 19.05,19.36 v17.58,17.88
  Bottom 0.305: v17.58,17.88 17.58,17.72 JP1.5
SCK
  Top 0.152: U$4.9 11.34,8.22 11.68,7.87 11.68,7.24 10.67,6.22 10.67,2.29 11.18,1.78 11.68,1.78 12.19,1.14 14.86,1.14 15.37,1.65 DAC2.SCK
  Top 0.203: DAC1.SCK 4,1.97 3.68,2.29 3.68,2.92 5.21,4.45 5.21,6.56 U2.P4
  Top 0.305: U$4.9 9.74,8.22 8.64,7.11 6.68,7.11 U2.P4
SCL  (via drill 0.5)
  Top 0.254: v15.24,11.43 15.24,8.89 14.66,8.31 U$4.18
  Top 0.356: R15.2 25.22,9.37 26.16,8.43 v26.16,7.62
  Bottom 0.203: U3.2 22.89,7.46 23.24,7.11 25.65,7.11 v26.16,7.62 26.75,8.2 26.75,12.32 24.97,14.1 22.2,14.1 21.54,14.76 19.05,14.76 18.95,14.66 17.58,14.66 15.24,12.32 v15.24,11.43
SDA  (via drill 0.5)
  Top 0.203: v25.88,11.86 24.64,10.62 R16.2
  Top 0.254: v16.26,11.43 16.26,8.64 15.16,7.54 U$4.19
  Bottom 0.203: U3.1 25.52,8 25.88,8.36 v25.88,11.86 25.88,12.09 24.26,13.72 21.44,13.72 20.75,14.4 19.23,14.4 19.13,14.3 17.8,14.3 16.26,12.75 v16.26,11.43

### Text on the board
tNames: Cerebro / 5.1 | ON